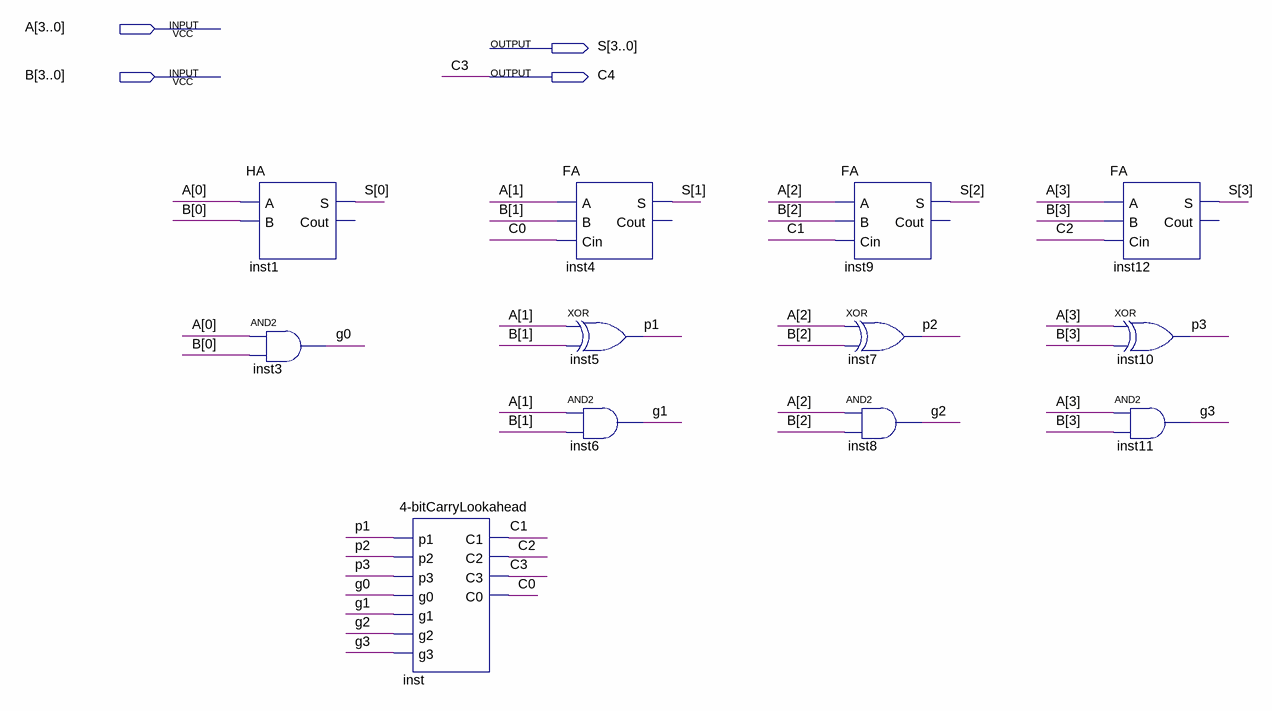
[diagram p0: schematic sheet]
// Quartus schematic CLA.bdf as structural Verilog: 12 symbols, 4 pins
module CLA (
  input  [3:0] A,
  input  [3:0] B,
  output [3:0] S,
  output C4
);

  wire C0, C1, C2, g0, g1, g2, g3, p1, p2, p3;

  HA inst1 (.A(A[0]), .B(B[0]), .S(S[0]));  // open: Cout
  and inst3 (g0, A[0], B[0]);
  \4-bitCarryLookahead  inst (
    .p1(p1), .p2(p2), .p3(p3), .g0(g0), .g1(g1), .g2(g2), .g3(g3), .C1(C1), .C2(C2), .C3(C4), .C0(C0));
  FA inst4 (.A(A[1]), .B(B[1]), .Cin(C0), .S(S[1]));  // open: Cout
  xor inst5 (p1, A[1], B[1]);
  and inst6 (g1, A[1], B[1]);
  FA inst9 (.A(A[2]), .B(B[2]), .Cin(C1), .S(S[2]));  // open: Cout
  xor inst7 (p2, A[2], B[2]);
  and inst8 (g2, A[2], B[2]);
  FA inst12 (.A(A[3]), .B(B[3]), .Cin(C2), .S(S[3]));  // open: Cout
  xor inst10 (p3, A[3], B[3]);
  and inst11 (g3, A[3], B[3]);

  // Other names for the same wires on the sheet: C3 = C4
endmodule
